# Altium project Коммутационная плата 468353_001.PrjPcb
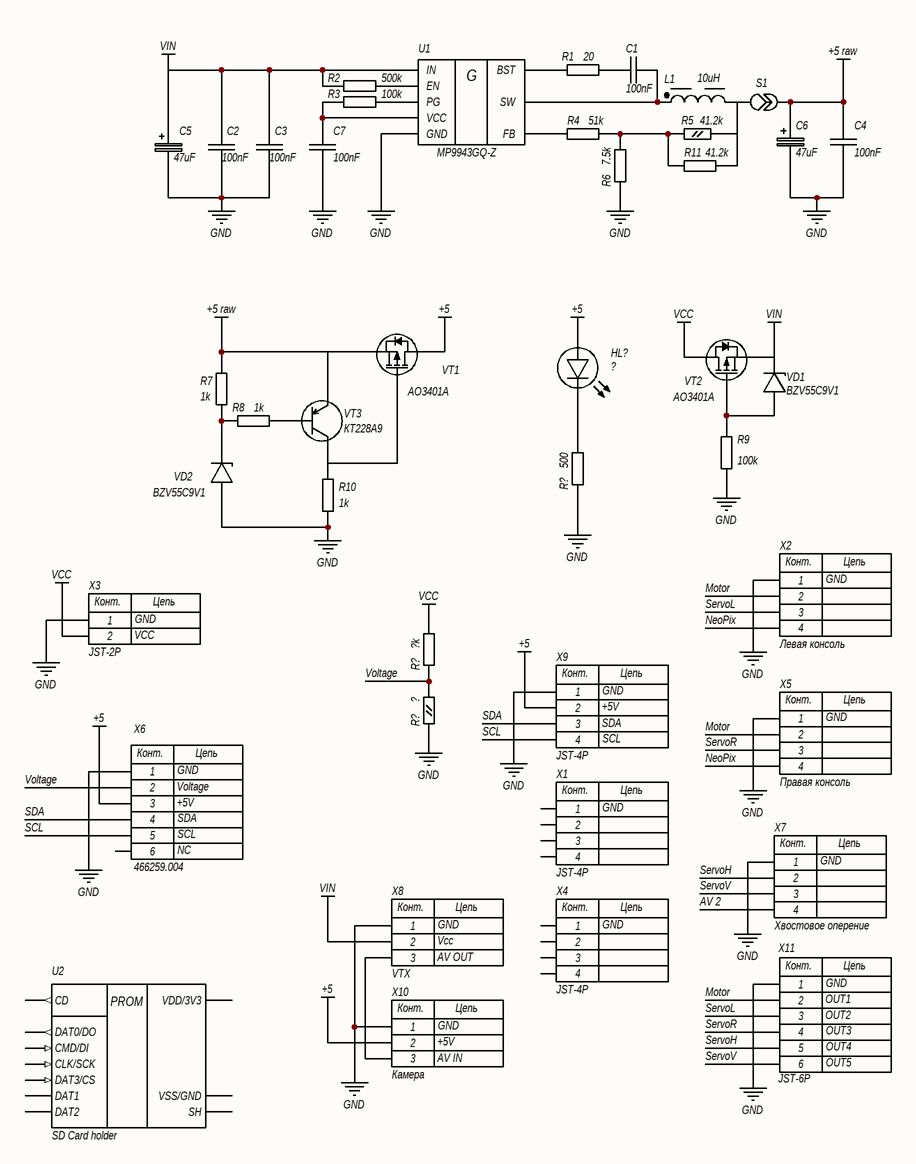
[diagram p0: Принципиальная схема 468353_001.SchDoc]
1 sheet, 42 parts. Net scope: global (net labels, ports and power ports of the same name join across sheets).
Board file: Печатная плата 468353_001.PcbDoc

## Sheet Принципиальная схема 468353_001.SchDoc: Плата коммутационная
size 209 x 297 mm; CompanyName: MOSTЫ; SheetNumber: 1; SheetTotal: 1; PageSetup: Record=PageOptions|CenterHorizontal=True|CenterVertical=True|PrintScale=0.94|XCorrection=1.00|YCorrection=1.00|PrintKind=1|BorderSize=5000000|LeftOffset=0|BottomOffset=0|Orientation=1|PaperLength=1000|PaperWidth=1000|Scale=100|PaperSource=7|PrintQuality=-4|MediaType=1|DitherType=10|PaperKind=A4|PrintScaleMode=1; DecimalNumber: XXXX.468353.001; Name1: Плата коммутационная; lit_A: О; Name2: полётного контроллера; DocumentName: Sheet1.SCHDOC

### Parts
(Parts that share a designator on the sheet are numbered #1, #2 ... from top to bottom, then left to right.)
C1  100nF  [CAPC2012X10N]
C2  100nF  [CAPC2012X10N]
C3  100nF  [CAPC2012X10N]
C4  100nF  [CAPC2012X10N]
C5  47uF  [FP-TPSD-MFG]
C6  47uF  [FP-TPSD-MFG]
C7  100nF  [CAPC2012X10N]
HL?  ?  [LED 0805]
L1  10uH  [WE-TPC_4828]
R1  20  [RES0805]
R2  500k  [RES0805]
R3  100k  [RES0805]
R4  51k  [RES0805]
R5  41.2k  [МЛТ-0.125]
R6  7.5k  [RES0805]
R7  1k  [RES0805]
R8  1k  [RES0805]
R9  100k  [RES0805]
R10  1k  [RES0805]
R11  41.2k  [RES0805]
R?#1  500  [RES0805]
R?#2  ?k  [RES0805]
R?#3  ?  [МЛТ-0.125]
S1  (no value)  [Solder bridge middle]
U1  MP9943GQ-Z  [MP9943 QFN8]
U2  SD Card holder  [SD Card holder]
VD1  BZV55C9V1  [FP-DO-213AA-MFG]
VD2  BZV55C9V1  [FP-DO-213AA-MFG]
VT1  AO3401A  [SOT-23]
VT2  AO3401A  [SOT-23]
VT3  КТ228А9  [SOT-23]
X1  JST-4P  [JST-SH04B]
X2  Левая консоль  [FP-53048-0410-MFG]
X3  JST-2P  [FP-S2B-XH-A-1_LF_SN-MFG]
X4  JST-4P  [JST-SH04B]
X5  Правая консоль  [FP-53048-0410-MFG]
X6  466259.004  [466259.004]
X7  Хвостовое оперение  [FP-53048-0410-MFG]
X8  VTX  [JST-SM03B-SRSS-TB_V]
X9  JST-4P  [JST-SH04B]
X10  Камера  [FP-53048-0310-MFG]
X11  JST-6P  [JST-SM06B-SRSS-TB_V]

### Nets
+5: HL?.1 VT1.3(DRAIN) X6.3 X9.2 X10.2
+5 raw: C4.1(+) C6.2(-) R7.2 S1.2 VT1.2(SOURCE) VT3.2(E)
GND: C2.2(-) C3.2(-) C4.2(-) C5.1(+) C6.1(+) C7.2(-) R6.1 R9.1 R10.1 R?#1.1 R?#3.1 U1.5(GND) VD2.2 X2.1 X3.1 X5.1 X6.1 X7.1 X8.1 X9.1 X10.1 X11.1
VCC: R?#2.2 VT2.3(DRAIN) X3.2
VIN: C2.1(+) C3.1(+) C5.2(-) R2.1 U1.7(IN) VD1.1 VT2.2(SOURCE) X8.2
AV 2: X7.4
Motor: X2.2 X5.2 X11.2
NeoPix: X2.4 X5.4
SCL: X6.5 X9.4
SDA: X6.4 X9.3
ServoH: X7.2 X11.5
ServoL: X2.3 X11.3
ServoR: X5.3 X11.4
ServoV: X7.3 X11.6
Voltage: R?#2.1 R?#3.2 X6.2
NetC1_1: C1.1(+) L1.1 U1.6(SW)
NetC1_2: C1.2(-) R1.2
NetC7_1: C7.1(+) R3.1 U1.2(VCC)
NetHL?_2: HL?.2 R?#1.2
NetL1_2: L1.2 R5.2 R11.2 S1.1
NetR1_1: R1.1 U1.4(BST)
NetR2_2: R2.2 U1.3(EN)
NetR3_2: R3.2 U1.8(PG)
NetR4_1: R4.1 U1.1(FB)
NetR4_2: R4.2 R5.1 R6.2 R11.1
NetR7_1: R7.1 R8.1 VD2.1
NetR8_2: R8.2 VT3.1(B)
NetR9_2: R9.2 VD1.2 VT2.1(GATE)
NetR10_2: R10.2 VT1.1(GATE) VT3.3(C)
NetX8_3: X8.3 X10.3

Not connected (* = marked no-connect by the designer): U2 1(DAT2) 2(DAT3/CS) 3(CMD/DI) 4(VDD/3V3) 5(CLK/SCK) 6(VSS/GND) 7(DAT0/DO) 8(DAT1) 9(CD) SH; X1 1 2 3 4; X4 1 2 3 4; X6 6

### Notes on the sheet
- Перв.примен.
- Справ.№
- Подп. и дата
- Инв.№ дубл.
- Взам.инв.№
- Подп.и дата
- Разраб.
- Изм.
- Лист
- № докум.
- Подп.
- Дата
- Лит.
- Масштаб
- Масса
- Т.контр.
- Пров.
- СХЕМА   ЭЛЕКТРИЧЕСКАЯ
- ПРИНЦИПИАЛЬНАЯ
- Листов
- Инв.№ подл.
- Утв.
- Н.контр.
- Нач.сект.
- (in symbol 466259.004) Конт.; Цепь; GND; Voltage; +5V; SDA; SCL; NC
- (in symbol JST-2P) Конт.; Цепь
- (in symbol JST-3P) Конт.; Цепь
- (in symbol JST-4P) Конт.; Цепь
- (in symbol JST-6P) Конт.; Цепь
- (in symbol MP9943GQ-Z) G
- (in symbol SD Card holder) PROM

### Library data of the parts
C1-C4 C7 = Конденсатор керамика: ClassName: DCDC
C5 C6 = Конденсатор танталовый: Capacitor Polarised; Manufacturer_Name: Vishay; Manufacturer_Part_Number: 293D475X9010A2TE3; Datasheet Link: http://www.vishay.com/docs/40002/293d.pdf; Height: 1.8mm; Mouser Part Number: 74-293D475X9010A2TE3; Mouser Price/Stock: https://www.mouser.co.uk/ProductDetail/Vishay-Sprague/293D475X9010A2TE3?qs=zj6zwI%252Bv92RDYyeabgx%252B6w%3D%3D; Arrow Part Number: 293D475X9010A2TE3; Arrow Price/Stock: https://www.arrow.com/en/products/293d475x9010a2te3/vishay; ClassName: DCDC
HL? = Светодиод
L1 = Дроссель: NexarPartId: 22866852; RMS Current (Irms): 420mA; Shielding: Shielded; Inductance: 150µH; Self Resonant Frequency: 7MHz; Saturation Current: 220mA; Core Material: Ferrite; Inductance Tolerance: 30%; DC Resistance (DCR): 770mΩ; Test Frequency: 100kHz; Max Operating Temperature: 125°C; Case/Package: 1919; Height - Seated (Max): 2.9972mm; Packaging: Tape & Reel (TR); Case Code (Imperial): 1919; Min Operating Temperature: -40°C; Current Rating: 420mA; Width: 4.8mm; Ambient Temperature Range High: 95°C; Ambient Temperature Range Low: -40°C; Mount: Surface Mount; Composition: Wirewound; Number of Pins: 2; REACH SVHC: Unknown; RoHS: Compliant; Case Code (Metric): 4848; Tolerance: 30%; Height: 2.8mm; Length: 4.8mm; Max DC Current: 420mA; Termination: SMD/SMT; ClassName: DCDC
R1-R4 R6-R11 R?#1 R?#2 = Резистор SMD: SMD resistors with differents footprints
  R1-R4 R6 R11: ClassName: DCDC
  R7 R8 R10: ClassName: Overvoltage
  R9: ClassName: Reversevoltage
R5 R?#3 = МЛТ-0.125
  R5: ClassName: DCDC
S1 = Запаиваемая перемычка: Нормально замкнута
U1 = MP9943GQ-Z: High Efficiency 3A Peak, 36V, / Synchronous Step Down Converter / With Power Good; ClassName: DCDC
VD1 VD2 = Стабилитрон
  VD1: ClassName: Reversevoltage
  VD2: ClassName: Overvoltage
VT1 VT2 = P-MOS: P-Channel MOSFET; Manufacturer: Alpha and Omega; Output Power (Max): NotRequiredW; Power Dissipation: 1.4W; Rad Hardened: No; Drain Efficiency: NotRequired%; Drain-Source On-Volt: 30V; Noise Figure: NotRequireddB; Frequency (Max): NotRequiredMHz; Number of  Elements: 1; Gate-Source Voltage (Max): ?12V; Drain Current (Max): 4A; Channel Mode: Enhancement; Drain-Source On-Res: 0.044ohm; Type: PowerMOSFET; Polarity: P; Package URL: http://www.aosmd.com/res/packaging_information/SOT-23-3L.pdf; Datasheet URL: http://www.aosmd.com/res/data_sheets/AO3401A.pdf; Package Type: SOT-23; Package Description: 3-Pin Small Outline Transistor, Body 2.95 x 1.6 mm, Pitch 0.95 mm; Mounting: SurfaceMount; Manufacturer URL: http://www.aosmd.com/; Continuous Drain Current: 4A; Package Reference: SOT-23-3L; Mounting Technology: SurfaceMount; Operating Temperature Classification: Military; Power Gain: NotRequireddB; Datasheet Version: Rev. 3, 03/2011; Operating Temp Range: -55Cto150C; Pin Count: 3
  VT1: ClassName: Overvoltage
  VT2: ClassName: Reversevoltage
VT3 = PNP транзистор: PNP TRANSISTOR; Max Collector Current: 1.5A; Transition Frequency: 100MHz; Max Breakdown Voltage: 25V; Collector Emitter Voltage (VCEO): 400mV; Max Power Dissipation: 300mW; Case/Package: TO-236-3; Packaging: Tape and Reel; RoHS Compliant: Yes; Mount: Surface Mount; Collector Emitter Breakdown Voltage: 25V; ClassName: Overvoltage
X1 X2 X4 X5 X7 = JST-4P: JST type connector; Net1: GND
X3 = JST-2P: JST type connector; Net1: GND; Net2: VCC
X8 = JST-3P: JST type connector; Net1: GND; Net2: Vcc; Net3: AV OUT
X9 = JST-4P: JST type connector; Net1: GND; Net2: +5V; Net3: SDA; Net4: SCL
X10 = JST-3P: JST type connector; Net1: GND; Net2: +5V; Net3: AV IN
X11 = JST-6P: JST type connector; Net1: GND; Net2: OUT1; Net3: OUT2; Net4: OUT3; Net5: OUT4; Net6: OUT5